# EAGLE design 6-way-pot-scanner-module (EAGLE 9.6.2)
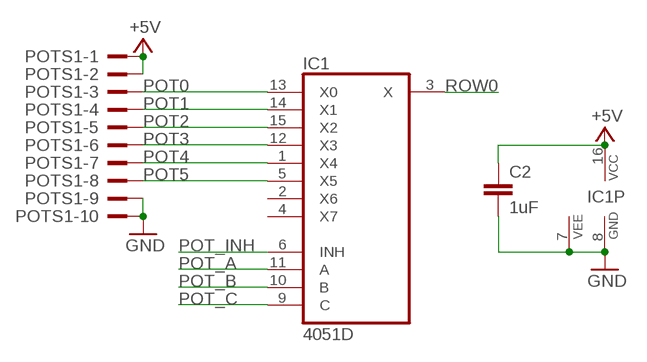
[diagram p0: schematic, sheet 1]

## Parts
C2  1uF  C-EU-J0603  [C0603-J]
IC1  4051D  [SO16]
POTS1  CONN-IDC-10PS  [CONN-IDC10P-S]

## Nets
+5V: C2.1 IC1.16(VCC) POTS1.1 POTS1.2
GND: C2.2 IC1.7(VEE) IC1.8(GND) POTS1.9 POTS1.10
POT0: IC1.13(X0) POTS1.3
POT1: IC1.14(X1) POTS1.4
POT2: IC1.15(X2) POTS1.5
POT3: IC1.12(X3) POTS1.6
POT4: IC1.1(X4) POTS1.7
POT5: IC1.5(X5) POTS1.8
POT_A: IC1.11(A)
POT_B: IC1.10(B)
POT_C: IC1.9(C)
POT_INH: IC1.6(INH)
ROW0: IC1.3(X)
Unconnected: IC1.2(X6) IC1.4(X7)

## Library data of the parts
C2 = joakim:C-EU-J: CAPACITOR, European symbol
IC1 = 40xx:4051: 8-channel ANALOG MULTIPLEXER
POTS1 = joakim:CONN-IDC-10P: 10P IDC Header

## Board
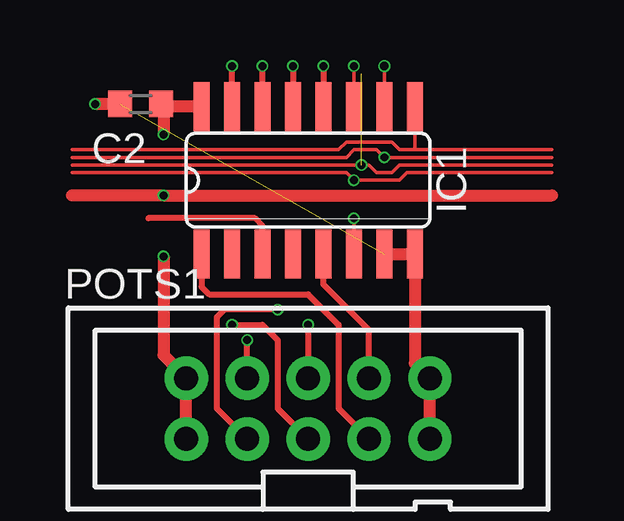
[diagram p1: board, top side]
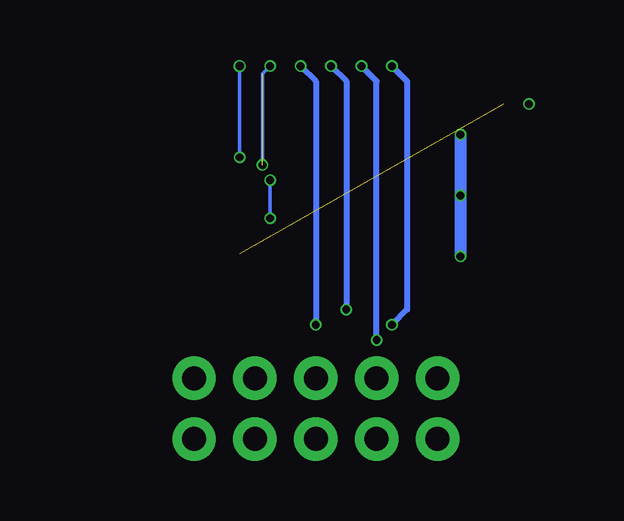
[diagram p2: board, bottom side, seen from below]

No outline drawn. Coordinates in mm, seen from the top.
Copper layers (1*16): Top 0.035mm / dielectric 1.6mm / Bottom 0.035mm
Design rules "jlcpcb-2layers": minimum track width 5mil, minimum drill 0.3mm, track to track 5mil, track to pad 5mil, pad to pad 5mil, via to via 5mil, smd to smd 5mil, copper to edge 0.2mm, drill to drill 6mil, minimum pad ring 10mil, minimum via ring 3mil, stop-mask expansion 4mil, vias tented up to drill 0mil, thermal gap 10mil

### Footprints (pad centres in the part's own frame; a part is rotated, then mirrored left to right if it is on the bottom)
C0603-J = smd 1 x 1.1: 1 -0.85,0; 2 0.85,0
SO16 = smd 0.66 x 2.032: 1 -4.445,-3.073; 2 -3.175,-3.073; 3 -1.905,-3.073; 4 -0.635,-3.073; 5 0.635,-3.073; 6 1.905,-3.073; 7 3.175,-3.073; 8 4.445,-3.073; 9 4.445,3.073; 10 3.175,3.073; 11 1.905,3.073; 12 0.635,3.073; 13 -0.635,3.073; 14 -1.905,3.073; 15 -3.175,3.073; 16 -4.445,3.073
CONN-IDC10P-S = drill 1 pad 1.422: 1 -5.08,-1.27; 2 -5.08,1.27; 3 -2.54,-1.27; 4 -2.54,1.27; 5 0,-1.27; 6 0,1.27; 7 2.54,-1.27; 8 2.54,1.27; 9 5.08,-1.27; 10 5.08,1.27

### Placement (x,y rotation side)
C2  3.17,17.78 180 top
IC1  10.16,14.61 0 top
POTS1  10.16,5.08 0 top

### Tracks (layer width: path | path; a pad name or v marks a point on that pad's centre or on a via)
+5V  (via drill 0.33)
  Top 0.508: IC1.16 4.13,17.68 C2.1 | POTS1.1 POTS1.2 4.13,7.3 v4.13,11.43 | C2.1 4.13,17.68 v4.13,16.51 | C2.1 4.13,17.88 | 20.32,13.97 v4.13,13.97 0.32,13.97
  Bottom 0.508: v4.13,16.51 v4.13,13.97 v4.13,11.43
GND  (via drill 0.33)  (1 unrouted)
  Top 0.508: IC1.7 IC1.8 14.61,6.99 POTS1.10 POTS1.9 | C2.2 v1.27,17.78
POT0  (via drill 0.33)
  Top 0.254: v9.53,19.37 IC1.13 | POTS1.3 6.35,5.08 6.35,8.89 6.67,9.21 v8.89,9.21
  Bottom 0.254: v8.89,9.21 8.89,18.73 v9.53,19.37
POT1  (via drill 0.33)
  Top 0.254: IC1.14 v8.26,19.37 | POTS1.4 v7.62,7.94
  Bottom 0.254: v7.62,7.94 7.62,18.73 v8.26,19.37
POT2  (via drill 0.33)
  Top 0.254: IC1.15 v6.99,19.37 | POTS1.5 8.89,5.08 8.89,7.94 8.26,8.57 v6.99,8.57
  Bottom 0.254: v6.99,19.37 6.35,18.73 6.35,9.21 v6.99,8.57
POT3  (via drill 0.33)
  Top 0.254: v10.79,19.37 IC1.12 | v10.16,8.57 POTS1.6
  Bottom 0.254: v10.16,8.57 10.16,18.73 v10.79,19.37
POT4
  Top 0.254: IC1.1 5.71,10.16 6.03,9.84 10.16,9.84 11.43,8.57 11.43,5.08 POTS1.7
POT5
  Top 0.254: POTS1.8 12.7,8.36 10.79,10.26 IC1.5
POT_A  (via drill 0.33)  (2 unrouted)
  Top 0.152: 20.32,15.24 13.97,15.24 13.65,14.92 13.02,14.92 12.7,15.24 v12.38,15.24 0.32,15.24 | IC1.11 v12.06,19.37
  Bottom 0.152: v12.06,19.37 12.38,19.05 v12.38,15.24
POT_B  (via drill 0.33, 0.35)
  Top 0.152: 20.32,15.56 v13.34,15.56 13.02,15.88 12.06,15.88 11.75,15.56 0.32,15.56 | v13.34,19.37 IC1.10
  Bottom 0.152: v13.34,15.56 v13.34,19.37
POT_C
  Top 0.152: 0.32,15.88 11.43,15.88 11.75,16.19 13.65,16.19 13.97,15.88 14.61,15.88 | 14.61,15.88 20.32,15.88 | IC1.9 14.61,15.88
POT_INH  (via drill 0.33)
  Top 0.152: 20.32,14.92 14.29,14.92 13.97,14.61 v12.06,14.61 11.75,14.92 0.32,14.92 | IC1.6 v12.06,13.02
  Bottom 0.152: v12.06,14.61 v12.06,13.02
ROW0
  Top 0.254: IC1.3 8.26,12.7 7.94,13.02 3.49,13.02